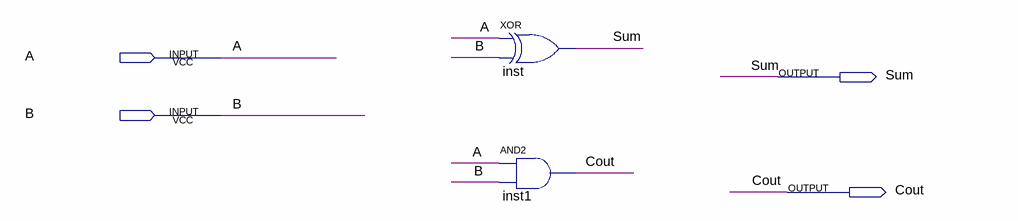
[diagram p0: schematic sheet]
// Quartus schematic halfadder.bdf as structural Verilog: 2 symbols, 4 pins
module halfadder (
  input  A,
  input  B,
  output Sum,
  output Cout
);

  xor inst (Sum, A, B);
  and inst1 (Cout, A, B);
endmodule
